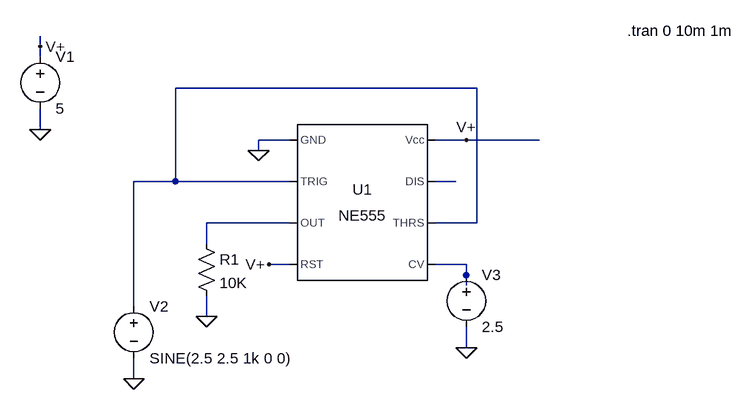
[diagram p0: schematic 555-pwm.asc]
555-pwm.asc, the LTspice schematic file:
Version 4
SHEET 1 1024 680
WIRE -112 96 -112 80
WIRE -112 112 -112 96
WIRE 560 160 96 160
WIRE -112 224 -112 192
WIRE 272 240 224 240
WIRE 544 240 496 240
WIRE 656 240 544 240
WIRE 224 256 224 240
WIRE 96 304 96 160
WIRE 96 304 32 304
WIRE 272 304 96 304
WIRE 528 304 496 304
WIRE 272 368 144 368
WIRE 560 368 560 160
WIRE 560 368 496 368
WIRE 144 400 144 368
WIRE 272 432 240 432
WIRE 544 432 496 432
WIRE 544 448 544 432
WIRE 544 464 544 448
WIRE 32 496 32 304
WIRE 144 512 144 480
WIRE 544 560 544 528
WIRE 32 608 32 576
FLAG 224 256 0
FLAG 32 608 0
FLAG -112 224 0
FLAG 544 560 0
FLAG -112 96 V+
FLAG 544 240 V+
FLAG 240 432 V+
FLAG 144 512 0
SYMBOL Misc/NE555 384 336 R0
SYMATTR InstName U1
SYMBOL voltage -112 96 R0
SYMATTR InstName V1
SYMATTR Value 5
SYMBOL voltage 32 480 R0
SYMATTR InstName V2
SYMATTR Value SINE(2.5 2.5 1k 0 0)
SYMBOL res 128 384 R0
SYMATTR InstName R1
SYMATTR Value 10K
SYMBOL voltage 544 432 R0
SYMATTR InstName V3
SYMATTR Value 2.5
TEXT 792 72 Left 2 !.tran 0 10m 1m

The netlist it stands for:
* 555-pwm.asc
XU1 0 N001 N003 V+ N004 N001 N002 V+ NE555  ; pins GND TRIG OUT RST CV THRS DIS Vcc
V1 V+ 0 5
V2 N001 0 SINE(2.5 2.5 1k 0 0)
R1 N003 0 10K
V3 N004 0 2.5
.tran 0 10m 1m
.lib NE555.sub
.backanno
.end